# EAGLE design PowerBoard (EAGLE 9.2.0)
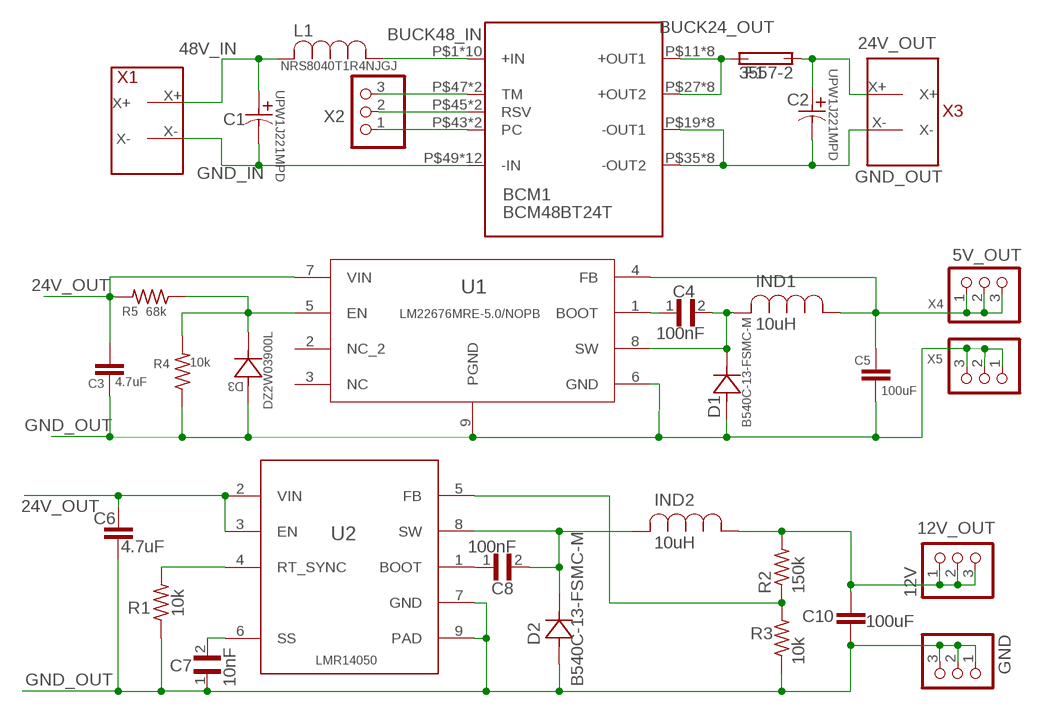
[diagram p0: schematic, sheet 1]

## Parts
12V  9-146281-0  [TE_9-146281-0]
BCM1  BCM48BT24T  [BCM48BT24T]
C1  UPW1J221MPD  [PCAP_10X20-THRU-ELECT]
C2  UPW1J221MPD  [PCAP_10X20-THRU-ELECT]
C3  4.7uF  4.7UF0603  [0603]
C4  100nF  GRM21BR60E107ME15L  [CAPC2012X135N]
C5  100uF  10UF-1210-50V-20%  [1210]
C6  4.7uF  4.7UF0603  [0603]
C7  10nF  GRM21BR60E107ME15L  [CAPC2012X135N]
C8  100nF  GRM21BR60E107ME15L  [CAPC2012X135N]
C10  100uF  10UF-1210-50V-20%  [1210]
D1  B540C-13-FSMC-M  [SMC-M]
D2  B540C-13-FSMC-M  [SMC-M]
D3  DZ2W03900L  [MINI2-F3-B]
F1  3557-2  [FUSE_3557-2]
GND  9-146281-0  [TE_9-146281-0]
IND1  10uH  ASPI-1040HIA  [11.15X10]
IND2  10uH  ASPI-1040HIA  [11.15X10]
L1  NRS8040T1R4NJGJ  [IND_TAIYO_NRS8040]
R1  10k  R-US_R0603  [R0603]
R2  150k  R-US_R0603  [R0603]
R3  10k  R-US_R0603  [R0603]
R4  10k  R-US_R0603  [R0603]
R5  68k  R-US_R0603  [R0603]
U1  LM22676MRE-5.0/NOPB  [MRA08B]
U2  LMR14050  LMR14050SDDAR  [DDA0008E_N]
X1  XT60  [XT60]
X2  9-146281-0  [TE_9-146281-0]
X3  XT60  [XT60]
X4  9-146281-0  [TE_9-146281-0]
X5  9-146281-0  [TE_9-146281-0]

## Nets
5V_BOOT [V5]: C4.1 U1.1(BOOT)
5V_EN [V5]: D3.1 R4.2 R5.1 U1.5(EN)
5V_IND [V5]: C4.2 D1.1 IND1.2 U1.8(SW)
5V_OUT [V5]: C5.1 IND1.1 U1.4(FB) X4.1 X4.2 X4.3
12V_BOOT [V12]: C8.1 U2.1(BOOT)
12V_FB [V12]: R2.1 R3.2 U2.5(FB)
12V_OUT [V12]: 12V.1 12V.2 12V.3 C10.1 IND2.1 R2.2
12V_RT_SYNC [V12]: R1.2 U2.4(RT_SYNC)
12V_SS [V12]: C7.2 U2.6(SS)
12V_SW [V12]: C8.2 D2.1 IND2.2 U2.8(SW)
24V_OUT [V24]: C2.1 C3.1 C6.1 F1.3(2A) F1.4(2A) R5.2 U1.7(VIN) U2.2(VIN) U2.3(EN) X3.X+
48V_IN [V48]: C1.1 L1.2 X1.X+
48V_PC: BCM1.P$43(PC) BCM1.P$44(PC) X2.1
48V_RSV: BCM1.P$45(RSV) BCM1.P$46(RSV) X2.2
48V_TM: BCM1.P$47(TM) BCM1.P$48(TM) X2.3
BUCK24_OUT [V24]: BCM1.P$11(+OUT1) BCM1.P$12(+OUT1) BCM1.P$13(+OUT1) BCM1.P$14(+OUT1) BCM1.P$15(+OUT1) BCM1.P$16(+OUT1) BCM1.P$17(+OUT1) BCM1.P$18(+OUT1) BCM1.P$27(+OUT2) BCM1.P$28(+OUT2) BCM1.P$29(+OUT2) BCM1.P$30(+OUT2) BCM1.P$31(+OUT2) BCM1.P$32(+OUT2) BCM1.P$33(+OUT2) BCM1.P$34(+OUT2) F1.1(1A) F1.2(1A)
BUCK48_IN [V48]: BCM1.P$1(+IN) BCM1.P$2(+IN) BCM1.P$3(+IN) BCM1.P$4(+IN) BCM1.P$5(+IN) BCM1.P$6(+IN) BCM1.P$7(+IN) BCM1.P$8(+IN) BCM1.P$9(+IN) BCM1.P$10(+IN) L1.1
GND_IN [GND_IN]: BCM1.P$49(-IN) BCM1.P$50(-IN) BCM1.P$51(-IN) BCM1.P$52(-IN) BCM1.P$53(-IN) BCM1.P$54(-IN) BCM1.P$55(-IN) BCM1.P$56(-IN) BCM1.P$57(-IN) BCM1.P$58(-IN) BCM1.P$59(-IN) BCM1.P$60(-IN) C1.2 X1.X-
GND_OUT [GND_OUT]: BCM1.P$19(-OUT1) BCM1.P$20(-OUT1) BCM1.P$21(-OUT1) BCM1.P$22(-OUT1) BCM1.P$23(-OUT1) BCM1.P$24(-OUT1) BCM1.P$25(-OUT1) BCM1.P$26(-OUT1) BCM1.P$35(-OUT2) BCM1.P$36(-OUT2) BCM1.P$37(-OUT2) BCM1.P$38(-OUT2) BCM1.P$39(-OUT2) BCM1.P$40(-OUT2) BCM1.P$41(-OUT2) BCM1.P$42(-OUT2) C2.2 C3.2 C5.2 C6.2 C7.1 C10.2 D1.2 D2.2 D3.2 GND.1 GND.2 GND.3 R1.1 R3.1 R4.1 U1.6(GND) U1.9(PGND) U2.7(GND) U2.9(PAD) X3.X- X5.1 X5.2 X5.3
Unconnected: U1.2(NC_2) U1.3(NC)

## Library data of the parts
12V GND X2 X4 X5 = header_connector:9-146281-0: AMPMODU 40 Position Through-Hole Single Row Straight 2.54 mm Breakaway Header; AVAILABILITY: Good; CENTERLINE_PITCH: 2.54 mm[.1 in]; COMMENT: 9-146281-0; DESCRIPTION: 40 MODII HDR SRST B/A .100CL; EU_ROHS_COMPLIANCE: Compliant; LINK: http://www.te.com/usa-en/product-9-146281-0.html; MF: TE Connectivity; MP: 9-146281-0; NUMBER_OF_POSITIONS: 40; PACKAGE: FakePackage u; PRICE: 2.90 USD; PRODUCT_TYPE: Connector
BCM1 = BCM48BT24:BCM48BT24T
C1 C2 = CAP220uFTH:UPW1J221MPD; MANUFACTURER_PART_NUMBER: UPW1J221MPD; VENDOR: Nichicon
C3 C6 = SparkFun-Capacitors:4.7UF: 4.7µF ceramic capacitors A capacitor is a passive two-terminal electrical component used to store electrical energy temporarily in an electric field.; PROD_ID: CAP-08280
C4 C7 C8 = GRM21BR60E107ME15L:GRM21BR60E107ME15L: Cap Ceramic 100uF 2.5V X5R 20% SMD 0805 85°C Embossed Plastic T/R; AVAILABILITY: Unavailable; DESCRIPTION: Cap Ceramic 100uF 2.5V X5R 20% SMD 0805 85°C Embossed Plastic T/R; MF: Murata Electronics; MP: GRM21BR60E107ME15L; PACKAGE: 0805 Murata; PRICE: 0.64 USD
C5 C10 = SparkFun-Capacitors:10UF: 10.0µF ceramic capacitors A capacitor is a passive two-terminal electrical component used to store electrical energy temporarily in an electric field.; PROD_ID: CAP-09824; VALUE: 10uF
D1 D2 = DIO_B540C-13-FSMC:B540C-13-F; MANUFACTURER_PART_NUMBER: B540C13F; VENDOR: Diodes Inc
D3 = 3.9V_Zener_Diode:DZ2W03900L; MANUFACTURER_PART_NUMBER: DZ2W03900L; VENDOR: Panasonic
F1 = Fuse Holder 3557-2:3557-2: Clip; Auto Clips & Holders; 2-1 Holder For Standard & Low Profile Mini Fuses; AVAILABILITY: Good; DESCRIPTION: Clip; Auto Clips & Holders; 2-1 Holder For Standard & Low Profile Mini Fuses; MF: Keystone; MP: 3557-2; PACKAGE: None; PRICE: 0.82 USD
IND1 IND2 = IND_smd_10uH_7.5A:ASPI-1040HI
L1 = IND_smd_1uH_6A:NRS8040T1R4NJGJ; MANUFACTURER_PART_NUMBER: NRS8040T1R4NJGJ; VENDOR: TAIYO YUDEN
R1-R5 = resistor:R-US_: RESISTOR, American symbol
U1 = LM2267:LM22676MRE-5.0/NOPB; MANUFACTURER_PART_NUMBER: LM22676MRE5.0NOPB; VENDOR: National Semiconductor
U2 = 24vto12v:LMR14050SDDAR; APPLICATION_BUILDNUMBER: *; COMPTYPE: IC; MANUFACTURER: Texas Instruments; MANUFACTURER_NAME: Texas Instruments; MANUFACTURER_PART_NUMBER: LMR14050SDDAR; MOUNTTYPE: SMT; PACKAGEREFERENCE: DDA0008E; PARTNUMBER: LMR14050SDDAR; PIN_COUNT: 9; REFDES: RefDes; ROHS: Y; TYPE: TYPE; VALUE: Value
X1 X3 = XT60:XT60

## Net classes
0 default: width 0.406 mm, clearance 0.381 mm
1 V48: width 2.54 mm, clearance 0.381 mm
2 V24: width 0.889 mm, clearance 0.381 mm
3 V12: width 0.762 mm, clearance 0.381 mm
4 V5: width 0.889 mm, clearance 0.381 mm
5 GND_IN: width 2.54 mm, clearance 0.381 mm
6 GND_OUT: width 0.406 mm, clearance 0.381 mm

## Board
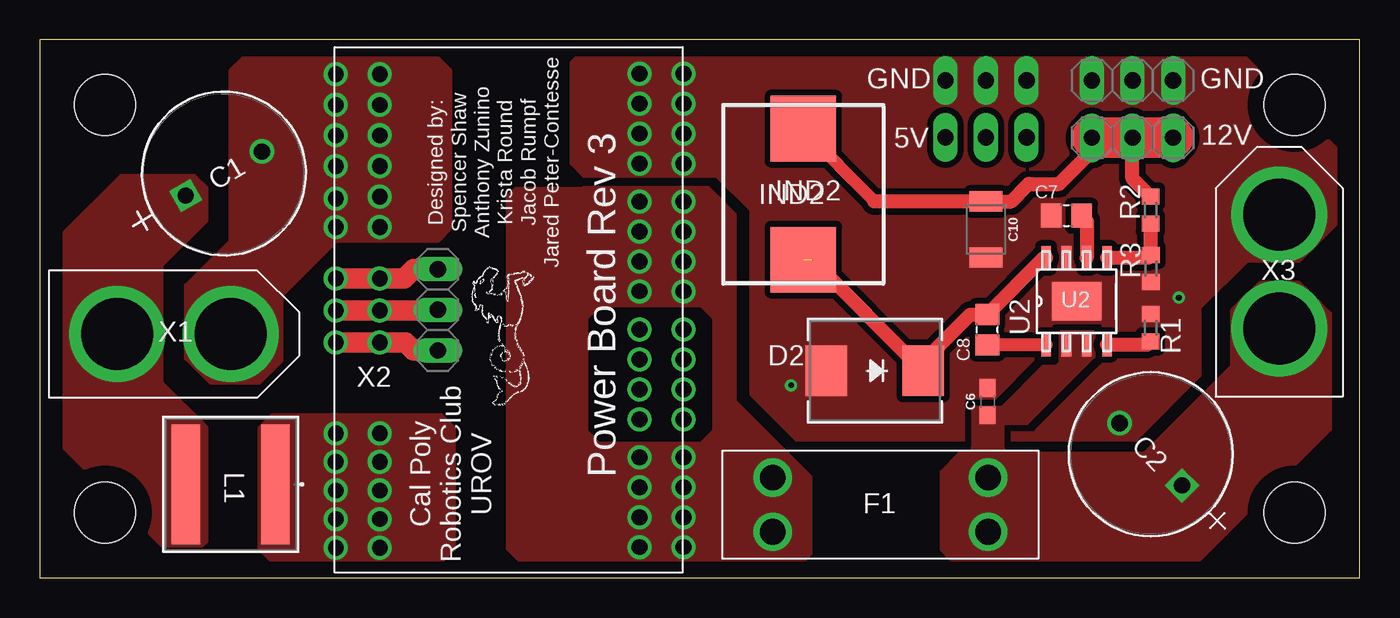
[diagram p1: board, top side]
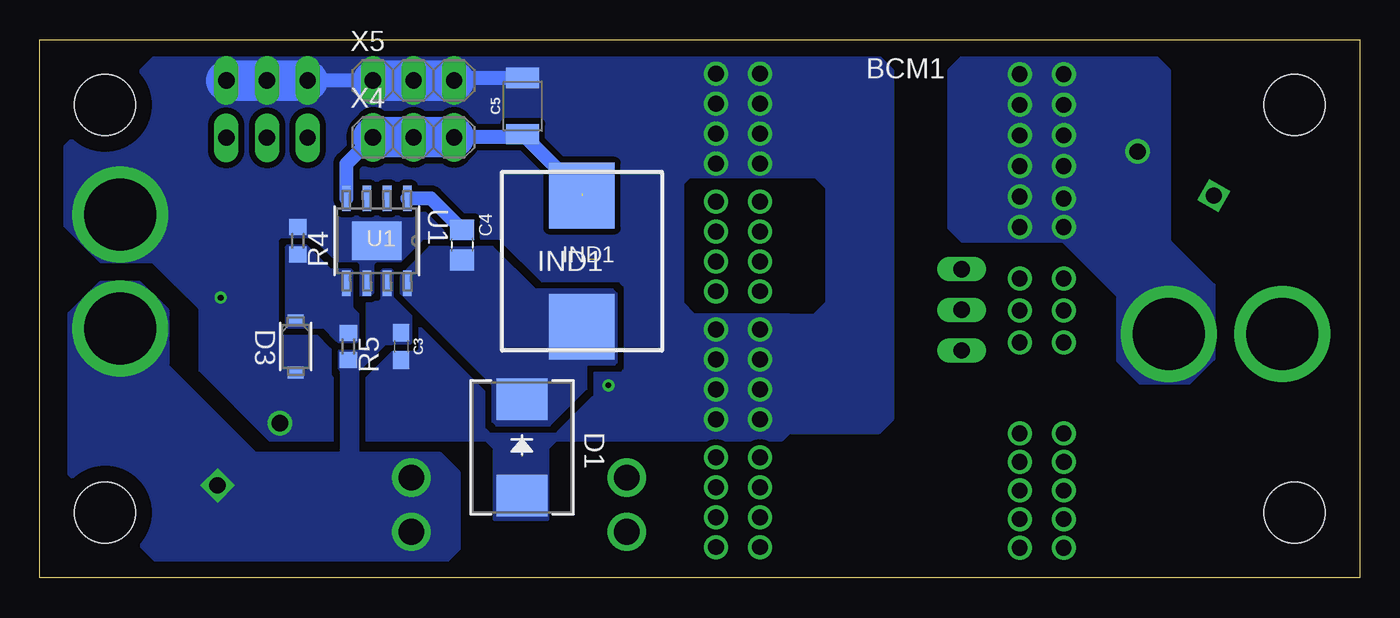
[diagram p2: board, bottom side, seen from below]

Size 82.55 x 33.66 mm. Coordinates in mm from the lower left corner, seen from the top.
Outline: 0,0 82.55,0 82.55,33.66 0,33.66 0,0
Copper layers (1*16): Top 0.035mm / dielectric 1.5mm / Bottom 0.035mm
Design rules "default": minimum track width 6mil, minimum drill 0.35mm, track to track 6mil, track to pad 6mil, pad to pad 6mil, via to via 6mil, smd to smd 6mil, copper to edge 40mil, drill to drill 6mil, minimum pad ring 10mil, minimum via ring 8mil, stop-mask expansion 4mil, vias tented up to drill 0mil, thermal gap 10mil
Holes 3.81 mm at 4.06,29.59 4.06,4.06 78.49,4.06 78.49,29.59

### Footprints (pad centres in the part's own frame; a part is rotated, then mirrored left to right if it is on the bottom)
TE_9-146281-0 = drill 1.016 long: 1 1.27,0; 2 3.81,0; 3 6.35,0
BCM48BT24T = drill 0.99 pad 1.5: P$1 7.95,14.89; P$2 10.7,14.89; P$3 10.7,13.1; P$4 7.95,13.1; P$5 10.7,11.31; P$6 7.95,11.31; P$7 10.719,9.52; P$8 7.95,9.52; P$9 10.7,7.73; P$10 7.95,7.73; P$11 -11.04,14.85; P$12 -8.29,14.85; P$13 -11.04,12.98; P$14 -8.29,12.98; P$15 -11.04,11.11; P$16 -8.29,11.11; P$17 -11.04,9.24; P$18 -8.29,9.24; P$19 -11.04,6.85; P$20 -8.29,6.85; P$21 -11.04,4.98; P$22 -8.29,4.98; P$23 -11.04,3.11; P$24 -8.29,3.11; P$25 -11.04,1.24; P$26 -8.29,1.24; P$27 -11.04,-1.16; P$28 -8.29,-1.16; P$29 -11.04,-3.03; P$30 -8.29,-3.03; P$31 -11.04,-4.9; P$32 -8.29,-4.9; P$33 -11.04,-6.77; P$34 -8.29,-6.77; P$35 -11.04,-9.16; P$36 -8.29,-9.16; P$37 -11.04,-11.03; P$38 -8.29,-11.03; P$39 -11.04,-12.9; P$40 -8.29,-12.9; P$41 -11.04,-14.77; P$42 -8.29,-14.77; P$43 10.7,2.04; P$44 7.95,2.04; P$45 10.7,0.04; P$46 7.95,0.04; P$47 10.7,-1.96; P$48 7.95,-1.96; P$49 10.7,-5.17; P$50 7.95,-5.17; P$51 10.7,-6.96; P$52 7.95,-7.09; P$53 10.7,-9; P$54 7.95,-9; P$55 10.7,-10.92; P$56 7.95,-10.92; P$57 10.7,-12.83; P$58 7.95,-12.83; P$59 10.7,-14.75; P$60 7.95,-14.75
PCAP_10X20-THRU-ELECT = drill 1.016 pad 1.524 square: 1 -2.972,0 | drill 1.016 pad 1.524: 2 2.54,0
0603 = smd 1.1 x 1: 1 -0.85,0; 2 0.85,0
CAPC2012X135N = smd 1.3 x 1.5: 1 -0.95,0; 2 0.95,0
1210 = smd 1.27 x 2.06: 1 -1.755,0; 2 1.755,0
SMC-M = smd 2.587 x 3.18: 1 -3.026,0; 2 3.026,0
MINI2-F3-B = smd 0.762 x 0.991: 1 -1.626,0; 2 1.626,0
FUSE_3557-2 = drill 1.6: 1 -6.735,1.7; 2 -6.735,-1.7; 3 6.735,1.7; 4 6.735,-1.7
11.15X10 = smd 4.1 x 4.1: 1 -4.1,0; 2 4.1,0
IND_TAIYO_NRS8040 = smd 1.791 x 7.493: 1 -2.8,0; 2 2.8,0
R0603 = smd 1 x 1.1: 1 -0.85,0; 2 0.85,0
MRA08B = smd 1.6 x 0.533: 1 -2.654,1.905; 2 -2.654,0.635; 3 -2.654,-0.635; 4 -2.654,-1.905; 5 2.654,-1.905; 6 2.654,-0.635; 7 2.654,0.635; 8 2.654,1.905 | smd 2.413 x 3.099: 9 0,0
DDA0008E_N = smd 1.45 x 0.6: 1 -2.725,1.905; 2 -2.725,0.635; 3 -2.725,-0.635; 4 -2.725,-1.905; 5 2.725,-1.905; 6 2.725,-0.635; 7 2.725,0.635; 8 2.725,1.905 | smd 2.4 x 3.1: 9 0,0
XT60 = drill 4.5 pad 6: X+ 0,-3.56; X- 0,3.56

### Placement (x,y rotation side)
12V  64.54,27.53 0 top
BCM1  29.21,16.76 180 top
C1  11.68,25.4 30 top
C2  69.34,7.87 135 top
C3  59.94,14.48 270 bottom
C4  56.13,20.83 270 bottom
C5  52.35,29.51 90 bottom
C6  59.28,11.02 90 top
C7  64.21,22.66 0 top
C8  59.26,15.52 90 top
C10  59.18,21.79 270 top
D1  52.4,8.15 270 bottom
D2  52.22,12.95 180 top
D3  66.55,14.48 270 bottom
F1  52.58,4.57 0 top
GND  64.54,31.11 0 top
IND1  48.64,19.81 270 bottom
IND2  47.75,24 270 top
L1  11.94,5.84 180 top
R1  69.47,15.65 270 top
R2  69.47,23.01 90 top
R3  69.49,19.35 90 top
R4  66.42,21.08 270 bottom
R5  63.25,14.48 270 bottom
U1  61.47,21.08 270 bottom
U2  64.85,17.3 90 top
X1  8.38,15.24 270 top
X2  24.89,12.95 90 top
X3  77.52,19.15 0 top
X4  62.99,27.56 0 bottom
X5  62.99,31.11 0 bottom

### Tracks (layer width: path | path; a pad name or v marks a point on that pad's centre or on a via)
5V_BOOT
  Bottom 0.889: C4.1 58.09,23.74 U1.1
5V_EN
  pour Bottom (no thermals): 64.39,19.3 63.12,19.3 62.99,19.18 62.99,16.89 62.61,16.51 62.61,14.86 62.74,14.73 63.88,14.73 64.01,14.86 64.77,15.62 66.42,15.62 67.06,15.62 67.18,15.75 67.18,20.7 67.06,20.83 65.91,20.83 65.79,20.7
5V_IND
  pour Bottom (no thermals): 54.23,12.06 54.23,9.78 53.98,9.53 50.67,9.53 48.39,11.81 48.39,13.21 48.26,13.34 46.61,13.34 46.48,13.46 46.48,17.78 46.74,18.03 51.56,18.03 54.23,20.7 58.17,20.7 59.94,18.92 59.94,17.78
5V_OUT  (1 unrouted)
  Bottom 0.889: 48.64,24.05 C5.1 52.55,27.56 X4.3 | U1.4 63.37,25.91 X4.1
  Bottom 2.54: X4.1 X4.2 X4.3
12V_BOOT
  Top 0.813: U2.1 C8.1
12V_FB
  Top 0.889: U2.5 69.31,20.02 R3.2 69.47,20.23 R2.1
12V_OUT
  Top 0.762: 52.2,23.55 47.75,28 IND2.1
  Top 0.889: 12V.1 65.81,26.7 63.75,24.64 61.85,24.64 60.76,23.55 C10.1 52.2,23.55 | R2.2 68.35,24.98 12V.2
  Top 2.54: 12V.3 12V.2 12V.1
12V_RT_SYNC
  Top 0.889: R1.2 69.25,14.57 U2.4
12V_SS
  Top 0.889: C7.2 65.48,22.34 U2.6
12V_SW  (1 unrouted)
  Top 0.889: 48.3,19.9 D2.1 56.01,13.72 56.01,14.27 58.21,16.47 C8.2 62.81,20.02 U2.8
24V_OUT
  pour Bottom (no thermals): 56.34,1.83 56.34,6.55 57.53,7.75 69.09,7.75 74.57,13.23 74.57,16.71 76.3,18.44 78.79,18.44 80.72,16.51 80.72,6.5 75.23,1.02 57.15,1.02
  pour Top (no thermals): 69.09,7.75 57.53,7.75 56.39,6.6 56.39,1.78 57.15,1.02 72.44,1.02 80.72,9.3 80.72,16.51 78.79,18.44 76.3,18.44 74.57,16.71 74.57,13.23
  pour Top (no thermals): 58.39,6.25 58.39,10.67 60.22,10.67 62.76,13.21 63.63,13.21 63.88,13.46 63.88,15.37 65.91,15.37 65.91,13.84 61.72,9.65 60.2,9.65 60.22,6.25
  pour Bottom (no thermals): 63.88,14.22 63.88,13.08 63.75,12.95 63.75,6.73 62.61,6.73 62.61,12.95 60.96,14.61 59.44,14.61 59.31,14.73 59.31,16.38 60.45,17.53 60.45,19.18 60.58,19.3 61.09,19.3 61.21,19.18 61.21,17.4 61.34,17.27 62.1,17.27 62.1,14.48 62.36,14.22
48V_IN
  pour Top (no thermals): 10.41,22.35 10.41,24.38 9.65,25.15 5.08,25.15 1.52,21.59 1.52,8.13 7.62,2.03 10.16,2.03 10.41,2.29 10.41,9.4 7.62,12.19 7.62,19.56
48V_PC
  Top 1.27: BCM1.P$43 BCM1.P$44 22.87,14.72 23.37,14.22 X2.1
48V_RSV
  Top 1.27: BCM1.P$45 BCM1.P$46 24.85,16.72 X2.2
48V_TM
  Top 1.27: BCM1.P$47 BCM1.P$48 22.79,18.72 23.37,19.3 X2.3
BUCK24_OUT
  pour Top (no thermals): 48.21,6.3 43.48,11.02 43.48,22.71 41.81,24.38 34.04,24.38 33.27,23.62 33.27,17.78 33.99,17.07 41.35,17.07 42.16,16.26 42.16,9.19 41.35,8.38 34.04,8.38 33.27,7.62 33.27,1.83 34.04,1.07 47.75,1.07 48.21,1.52
  pour Top: 40.64,24.33 29.77,24.33 29.26,23.83 29.26,1.83 30.02,1.07 40.84,1.07 41.35,1.57 41.35,7.57 40.54,8.38 34.95,8.38 34.19,9.14 34.19,16.26 35,17.07 40.69,17.07 41.45,17.83 41.45,23.52
BUCK48_IN
  pour Top (no thermals): 25.91,1.83 25.91,9.35 25.1,10.16 14.53,10.16 13.72,9.35 13.72,1.83 14.53,1.02 25.1,1.02
GND_IN
  pour Top (no thermals): 12.7,32.51 24.89,32.51 25.65,31.75 25.65,21.84 24.89,21.08 18.54,21.08 15.09,17.63 15.09,13.56 13.72,12.19 10.67,12.19 9.14,13.72 9.14,18.29 11.94,21.08 11.94,31.75
  pour Bottom (no thermals): 12.75,32.56 11.94,31.75 11.94,21.08 9.14,18.29 9.14,13.72 10.67,12.19 13.72,12.19 15.09,13.56 15.09,17.63 18.54,21.08 24.84,21.08 25.65,21.89 25.65,31.75 24.84,32.56
GND_OUT  (via drill 0.35)
  Bottom 0.889: C5.2 56.49,31.27 X5.3 | X5.1 GND.1
  Bottom 2.54: X5.3 X5.1 | GND.1 GND.3
  other vias: 46.99,12.04 71.25,17.53
  pour Bottom (isolate 0.254, rank 2, no thermals): 35.66,16.41 41.63,16.41 42.37,17.14 42.37,24.69 41.91,25.15 34.04,25.15 33.27,25.91 33.27,32.26 34.04,33.02 74.93,33.02 80.98,26.97 80.98,22.05 78.74,19.81 75.49,19.81 72.54,16.87 72.54,13.03 68.17,8.66 54.61,8.64 54.1,8.13 54.1,3.68 50.8,3.68 50.8,8.13 50.27,8.66 36.14,8.66 35.33,9.47 35.33,16.08
  pour Top (isolate 0.254, rank 3, no thermals): 42.37,25.15 34.04,25.15 33.27,25.91 33.27,32.26 34.04,33.02 74.93,33.02 81.03,26.92 81.03,22.1 78.74,19.81 75.49,19.81 72.54,16.87 72.54,12.65 68.53,8.64 47.35,8.64 44.5,11.48 44.5,23.01
  pour Bottom: 34.09,25.2 38.4,25.2 38.76,25.55 38.76,32.11 38.32,32.55 30.11,32.6 29.26,31.75 29.26,9.91 30.07,9.09 35.76,9.09 36.17,9.5 36.17,16.41 34.09,16.41 33.27,17.22 33.27,24.38

### Text on the board
tPlace: GND | 5V | Designed by: / Spencer Shaw / Anthony Zunino / Krista Round / Jacob Rumpf / Jared Peter-Contesse | IND2 | Power Board Rev 3 | U2 | Cal Poly / Robotics Club / UROV | /Users/q/Downloads/UROV Logo.bmp
bPlace: U1 | IND1